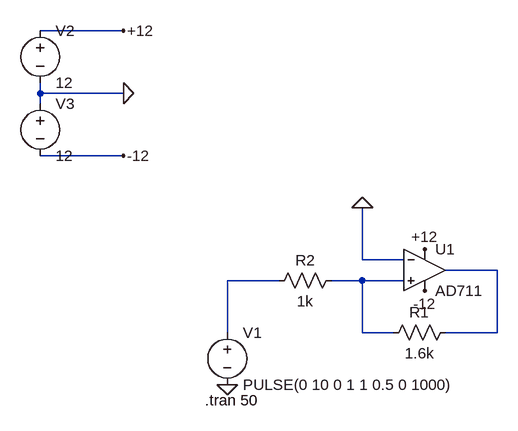
[diagram p0: schematic Montage 1.asc]
Montage 1.asc, the LTspice schematic file:
Version 4
SHEET 1 880 680
WIRE -80 -336 -208 -336
WIRE -208 -240 -208 -256
WIRE -80 -240 -208 -240
WIRE -208 -224 -208 -240
WIRE -80 -144 -208 -144
WIRE 288 16 288 -64
WIRE 352 16 288 16
WIRE 496 32 416 32
WIRE 160 48 80 48
WIRE 288 48 240 48
WIRE 352 48 288 48
WIRE 80 128 80 48
WIRE 288 128 288 48
WIRE 336 128 288 128
WIRE 496 128 496 32
WIRE 496 128 416 128
FLAG 288 -64 0
FLAG 80 208 0
FLAG -80 -240 0
FLAG -80 -336 +12
FLAG -80 -144 -12
FLAG 384 0 +12
FLAG 384 64 -12
SYMBOL voltage 80 112 R0
WINDOW 123 0 0 Left 0
WINDOW 39 0 0 Left 0
SYMATTR InstName V1
SYMATTR Value PULSE(0 10 0 1 1 0.5 0 1000)
SYMBOL OpAmps\\AD711 384 -32 R0
SYMATTR InstName U1
SYMBOL res 432 112 R90
WINDOW 0 0 56 VBottom 2
WINDOW 3 32 56 VTop 2
SYMATTR InstName R1
SYMATTR Value 1.6k
SYMBOL res 256 32 R90
WINDOW 0 0 56 VBottom 2
WINDOW 3 32 56 VTop 2
SYMATTR InstName R2
SYMATTR Value 1k
SYMBOL voltage -208 -352 R0
WINDOW 123 0 0 Left 0
WINDOW 39 0 0 Left 0
SYMATTR InstName V2
SYMATTR Value 12
SYMBOL voltage -208 -240 R0
WINDOW 123 0 0 Left 0
WINDOW 39 0 0 Left 0
SYMATTR InstName V3
SYMATTR Value 12
TEXT 46 232 Left 2 !.tran 50

The netlist it stands for:
* Montage 1.asc
V1 N002 0 PULSE(0 10 0 1 1 0.5 0 1000)
XU1 N003 0 +12 -12 N001 AD712  ; AD711, pins In+ In- V+ V- OUT
R1 N001 N003 1.6k
R2 N003 N002 1k
V2 +12 0 12
V3 0 -12 12
.tran 50
.lib ADI1.lib
.backanno
.end